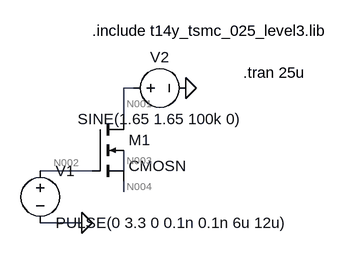
[diagram p0: schematic Draft4.asc]
Draft4.asc, the LTspice schematic file:
Version 4
SHEET 1 880 680
WIRE 176 80 160 80
WIRE 160 128 160 80
WIRE 112 208 32 208
WIRE 160 208 160 176
WIRE 160 240 160 224
WIRE 96 288 32 288
FLAG 256 80 0
FLAG 96 288 0
SYMBOL nmos4 112 128 R0
SYMATTR InstName M1
SYMATTR Value CMOSN
SYMATTR Value2 l=250n w=10u m=40
SYMBOL voltage 32 192 R0
WINDOW 123 0 0 Left 0
WINDOW 39 0 0 Left 0
SYMATTR InstName V1
SYMATTR Value PULSE(0 3.3 0 0.1n 0.1n 6u 12u)
SYMBOL voltage 160 80 R270
WINDOW 0 32 56 VTop 2
WINDOW 3 -32 56 VBottom 2
WINDOW 123 0 0 Left 0
WINDOW 39 0 0 Left 0
SYMATTR InstName V2
SYMATTR Value SINE(1.65 1.65 100k 0)
TEXT 112 -8 Left 2 !.include t14y_tsmc_025_level3.lib
TEXT 344 56 Left 2 !.tran 25u

The netlist it stands for:
* Draft4.asc
M1 N001 N002 N004 N003 CMOSN l=250n w=10u m=40
V1 N002 0 PULSE(0 3.3 0 0.1n 0.1n 6u 12u)
V2 N001 0 SINE(1.65 1.65 100k 0)
.model NMOS NMOS
.model PMOS PMOS
.lib standard.mos
.include t14y_tsmc_025_level3.lib
.tran 25u
.backanno
.end

* Results of the author's LTspice run, read from the files saved beside the schematic
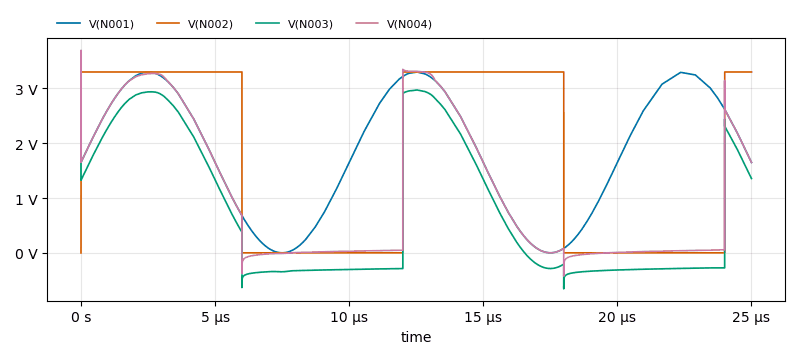
[diagram p1: Transient Analysis of Draft4.asc, plotted from the saved traces]
* Transient Analysis, 1 run:
*   V(N001): min 363.3 nV, max 3.3 V, average 1.857 V, rms 2.184 V, last 1.65 V
*   V(N002): min 0 V, max 3.3 V, average 1.716 V, rms 2.38 V, last 3.3 V
*   V(N003): min -656.6 mV, max 2.971 V, average 750.6 mV, rms 1.48 V, last 1.356 V
*   V(N004): min -423.5 mV, max 3.695 V, average 1.073 V, rms 1.672 V, last 1.65 V